# Altium project jiguang.PrjPcb
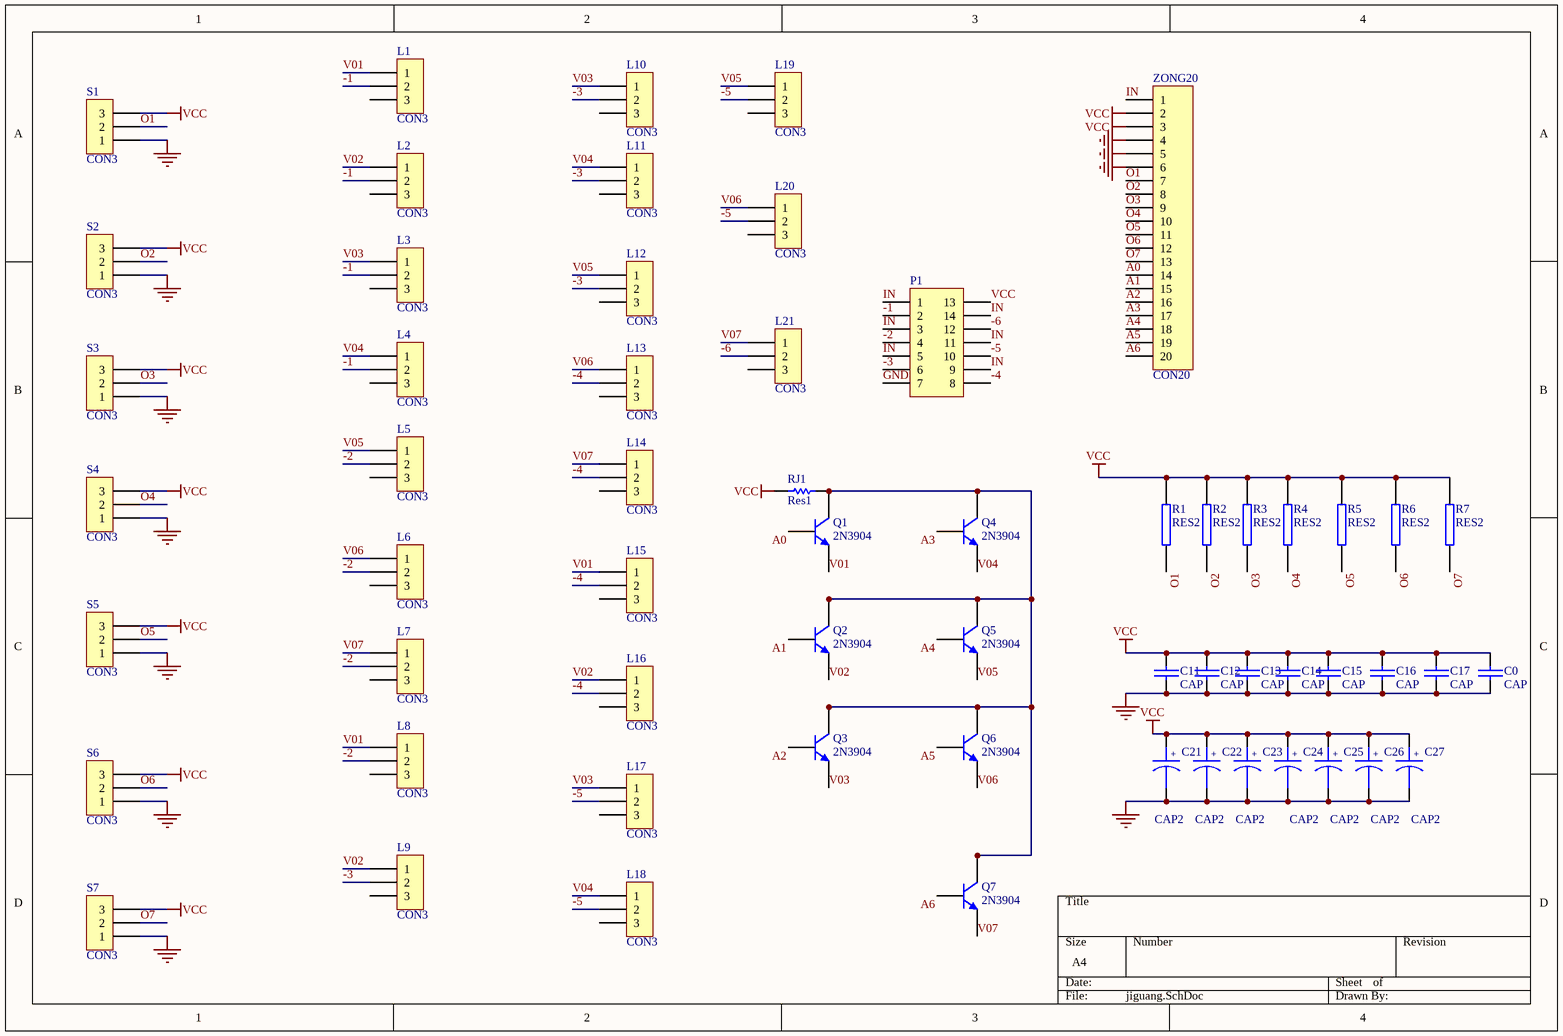
[diagram p0: jiguang.SchDoc]
1 sheet, 60 parts. Net scope: global (net labels, ports and power ports of the same name join across sheets).
Board file: jiguang.PcbDoc

## Sheet jiguang.SchDoc
size A4

### Parts
C0  CAP  [0805BB]
C11  CAP  [0805BB]
C12  CAP  [0805BB]
C13  CAP  [0805BB]
C14  CAP  [0805BB]
C15  CAP  [0805BB]
C16  CAP  [0805BB]
C17  CAP  [0805BB]
C21  CAP2  [3216B]
C22  CAP2  [3216B]
C23  CAP2  [3216B]
C24  CAP2  [3216B]
C25  CAP2  [3216B]
C26  CAP2  [3216B]
C27  CAP2  [3216B]
L1  CON3  [FASHE]
L2  CON3  [FASHE]
L3  CON3  [FASHE]
L4  CON3  [FASHE]
L5  CON3  [FASHE]
L6  CON3  [FASHE]
L7  CON3  [FASHE]
L8  CON3  [FASHE]
L9  CON3  [FASHE]
L10  CON3  [FASHE]
L11  CON3  [FASHE]
L12  CON3  [FASHE]
L13  CON3  [FASHE]
L14  CON3  [FASHE]
L15  CON3  [FASHE]
L16  CON3  [FASHE]
L17  CON3  [FASHE]
L18  CON3  [FASHE]
L19  CON3  [FASHE]
L20  CON3  [FASHE]
L21  CON3  [FASHE]
P1  Header 7X2A  [74LS04SOP]  (value not drawn)
Q1  2N3904  [3904]
Q2  2N3904  [3904]
Q3  2N3904  [3904]
Q4  2N3904  [3904]
Q5  2N3904  [3904]
Q6  2N3904  [3904]
Q7  2N3904  [3904]
R1  RES2  [0805BB]
R2  RES2  [0805BB]
R3  RES2  [0805BB]
R4  RES2  [0805BB]
R5  RES2  [0805BB]
R6  RES2  [0805BB]
R7  RES2  [0805BB]
RJ1  Res1  [0805]
S1  CON3  [JIESHOU]
S2  CON3  [JIESHOU]
S3  CON3  [JIESHOU]
S4  CON3  [JIESHOU]
S5  CON3  [JIESHOU]
S6  CON3  [JIESHOU]
S7  CON3  [JIESHOU]
ZONG20  CON20  [ZONG20]

### Nets
GND: C0.2 C11.2 C12.2 C13.2 C14.2 C15.2 C16.2 C17.2 C21.2 C22.2 C23.2 C24.2 C25.2 C26.2 C27.2 P1.7 S1.1 S2.1 S3.1 S4.1 S5.1 S6.1 S7.1 ZONG20.4 ZONG20.5 ZONG20.6
VCC: C0.1 C11.1 C12.1 C13.1 C14.1 C15.1 C16.1 C17.1 C21.1 C22.1 C23.1 C24.1 C25.1 C26.1 C27.1 P1.14(13) R1.2 R2.2 R3.2 R4.2 R5.2 R6.2 R7.2 RJ1.1 S1.3 S2.3 S3.3 S4.3 S5.3 S6.3 S7.3 ZONG20.2 ZONG20.3
-1: L1.2 L2.2 L3.2 L4.2 P1.2
-2: L5.2 L6.2 L7.2 L8.2 P1.4
-3: L9.2 L10.2 L11.2 L12.2 P1.6
-4: L13.2 L14.2 L15.2 L16.2 P1.8
-5: L17.2 L18.2 L19.2 L20.2 P1.10
-6: L21.2 P1.12
A0: Q1.2(E) ZONG20.14
A1: Q2.2(B) ZONG20.15
A2: Q3.2(E) ZONG20.16
A3: Q4.2(E) ZONG20.17
A4: Q5.2(E) ZONG20.18
A5: Q6.2(E) ZONG20.19
A6: Q7.2(E) ZONG20.20
IN: P1.1 P1.3 P1.5 P1.9 P1.11 P1.13(14) ZONG20.1
O1: R1.1 S1.2 ZONG20.7
O2: R2.1 S2.2 ZONG20.8
O3: R3.1 S3.2 ZONG20.9
O4: R4.1 S4.2 ZONG20.10
O5: R5.1 S5.2 ZONG20.11
O6: R6.1 S6.2 ZONG20.12
O7: R7.1 S7.2 ZONG20.13
V01: L1.1 L8.1 L15.1 Q1.1(B)
V02: L2.1 L9.1 L16.1 Q2.1(E)
V03: L3.1 L10.1 L17.1 Q3.1(B)
V04: L4.1 L11.1 L18.1 Q4.1(B)
V05: L5.1 L12.1 L19.1 Q5.1(B)
V06: L6.1 L13.1 L20.1 Q6.1(B)
V07: L7.1 L14.1 L21.1 Q7.1(B)
NetQ1_3: Q1.3(C) Q2.3(C) Q3.3(C) Q4.3(C) Q5.3(C) Q6.3(C) Q7.3(C) RJ1.2

Not connected (* = marked no-connect by the designer): L1 3; L2 3; L3 3; L4 3; L5 3; L6 3; L7 3; L8 3; L9 3; L10 3; L11 3; L12 3; L13 3; L14 3; L15 3; L16 3; L17 3; L18 3; L19 3; L20 3; L21 3

### Notes on the sheet
- (in symbol CAPACITOR POL) +

### Library data of the parts
C0 C11-C17 = CAP: Capacitor
C21-C27 = CAPACITOR POL: Capacitor
L1-L21 S1-S7 = CON3: Connector
P1 = Header 7X2A: Header, 7-Pin, Dual row; LatestRevisionDate: 17-Jul-2002; LatestRevisionNote: Re-released for DXP Platform.; Publisher: Altium Limited
Q1-Q7 = 2N3904: NPN General Purpose Amplifier; Published: 8-Jun-2000; LatestRevisionDate: 15-Jan-2003; LatestRevisionNote: PCB Footprint 'BCY-W3/D4.7' replaced; DatasheetDocument: 1997; PackageDocument: Sep-1998; PackageReference: TO-92A; Publisher: Altium Limited; Code_JEDEC: TO-92A; ComponentLink1Description: Manufacturer Link; ComponentLink1URL: http://www.fairchildsemi.com/; ComponentLink2Description: Datasheet; ComponentLink2URL: http://www.fairchildsemi.com/ds/2N%2F2N3904.pdf
RJ1 = Res1: Resistor; Value: 1K; Published: 8-Jun-2000; LatestRevisionDate: 17-Jul-2002; LatestRevisionNote: Re-released for DXP Platform.; PackageReference: AXIAL-0.3; Publisher: Altium Limited
ZONG20 = CON20: Connector